# Altium schematic sheet sdsheet.SchDoc
size A4
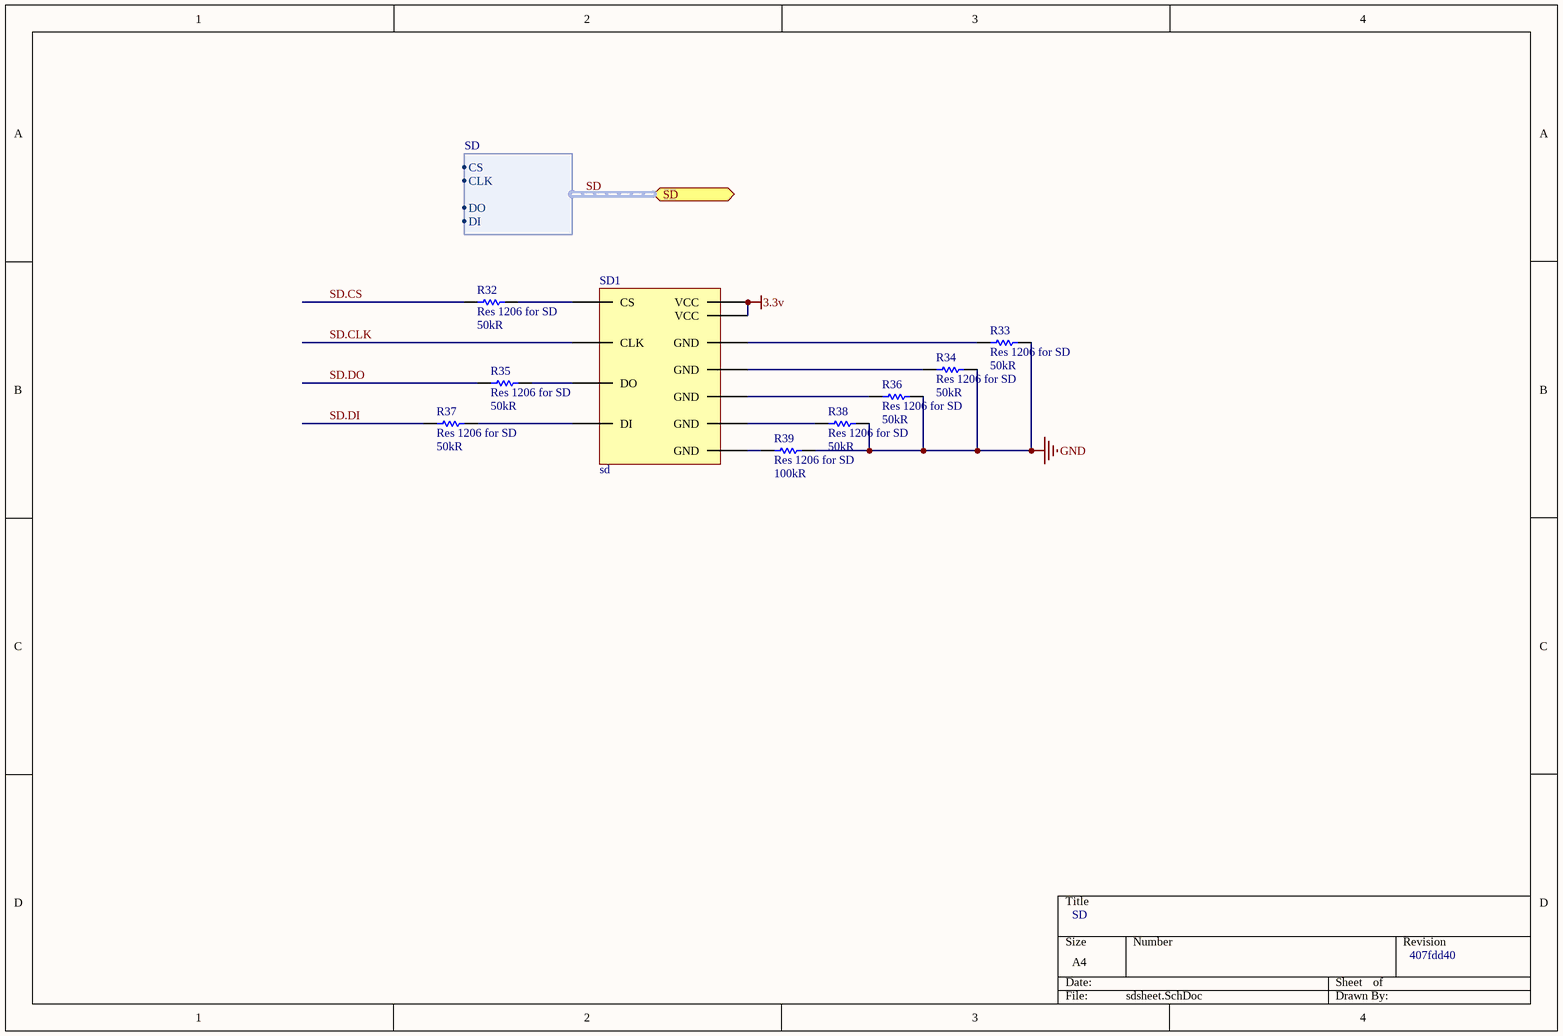
[diagram p0: sdsheet.SchDoc]

## Parts
R32  Res 1206 for SD  value 50kR  [RESC1206(3216)_M]
R33  Res 1206 for SD  value 50kR  [RESC1206(3216)_M]
R34  Res 1206 for SD  value 50kR  [RESC1206(3216)_M]
R35  Res 1206 for SD  value 50kR  [RESC1206(3216)_M]
R36  Res 1206 for SD  value 50kR  [RESC1206(3216)_M]
R37  Res 1206 for SD  value 50kR  [RESC1206(3216)_M]
R38  Res 1206 for SD  value 50kR  [RESC1206(3216)_M]
R39  Res 1206 for SD  value 100kR  [RESC1206(3216)_L]
SD1  sd  [Edge Connector - duplicate1]

## Ports
SD (harness SD)

## Harnesses
SD: CS, CLK, DO, DI

## Nets
3.3v: SD1.4(VCC) SD1.11(VCC)
GND: R33.2 R34.2 R36.2 R38.2 R39.2
SD.CLK: SD1.5(CLK)
SD.CS: R32.1
SD.DI: R37.1
SD.DO: R35.1
NetR32_2: R32.2 SD1.1(CS)
NetR33_1: R33.1 SD1.3(GND)
NetR34_1: R34.1 SD1.6(GND)
NetR35_2: R35.2 SD1.7(DO)
NetR36_1: R36.1 SD1.8(GND)
NetR37_2: R37.2 SD1.2(DI)
NetR38_1: R38.1 SD1.10(GND)
NetR39_1: R39.1 SD1.12(GND)

## Buses and harness runs
harness SD = port SD

## Notes on the sheet
- SD
- 407fdd40

## Library data of the parts
R32-R38 = CMP-1014-00702-1: 49K9 0.25W 1% 1206 (3216 Metric)  SMD; Case-EIA: 1206; Case-Metric: 3216; Technology: SMT; Tolerance: 1 %; Power: 0.25 W
R39 = CMP-1014-00736-1: 100K 0.25W 1% 1206 (3216 Metric)  SMD; Case-EIA: 1206; Case-Metric: 3216; Tolerance: 1 %; Power: 0.25 W; Technology: SMT